# Altium schematic sheet [2]_Power.SchDoc
size B
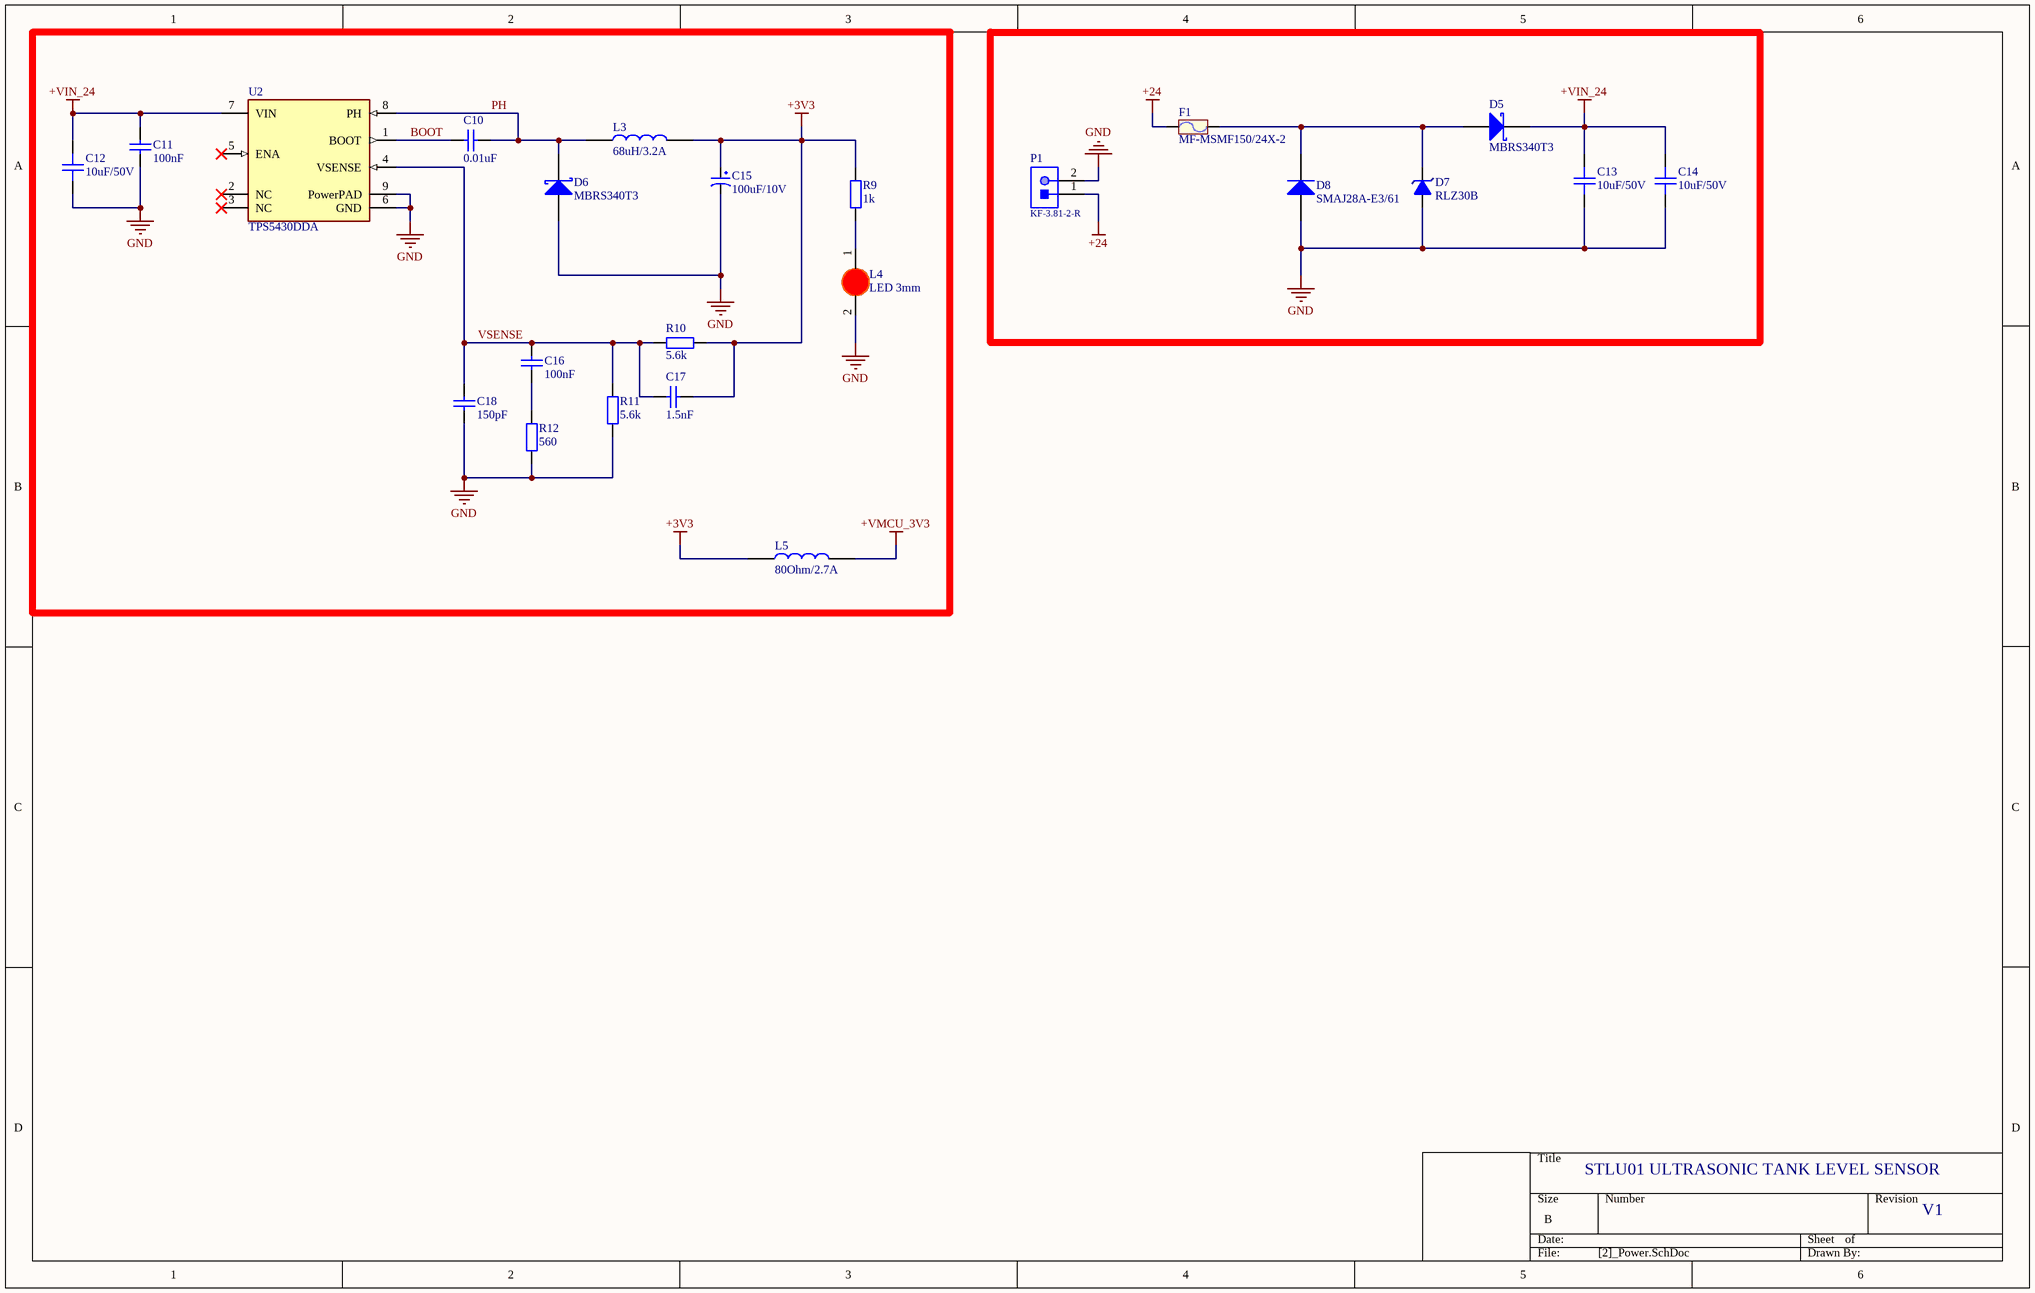
[diagram p0: [2]_Power.SchDoc]

## Parts
C10  0.01uF  [tu 0603]
C11  100nF  [tu 0805]
C12  10uF/50V  [1210]
C13  10uF/50V  [1210]
C14  10uF/50V  [1210]
C15  100uF/10V  [2312]
C16  100nF  [tu 0805]
C17  1.5nF  [tu 0805]
C18  150pF  [tu 0805]
D5  MBRS340T3  [DO214AB_SMC]
D6  MBRS340T3  [DO214AB_SMC]
D7  RLZ30B  [SOD_80]
D8  SMAJ28A-E3/61  [VISH-DO-214AC-2_L]
F1  MF-MSMF150/24X-2  [1812]
L3  68uH/3.2A  [IND-12_12_8]
L4  LED 3mm  [LED-3MM-RED]
L5  80Ohm/2.7A  [FER-0805 (2012)]
P1  KF-3.81-2-R  [691322310002]
R9  1k  [tro smd 0805]
R10  5.6k  [tro smd 0805]
R11  5.6k  [tro smd 0805]
R12  560  [tro smd 0805]
U2  TPS5430DDA  [FP-DDA0008J-MFG]

## Nets
+3V3: C15.1 C17.2 L3.2 L5.1 R9.2 R10.1
+24: F1.1 P1.1
+VIN_24: C11.1 C12.2 C13.2 C14.2 D5.2(K) U2.7(VIN)
+VMCU_3V3: L5.2
GND: C11.2 C12.1 C13.1 C14.1 C15.2 C18.2 D6.1(A) D7.1(A) D8.2(A) L4.2(K) P1.2 R11.1 R12.1 U2.6(GND) U2.9(PowerPAD)
BOOT: C10.2 U2.1(BOOT)
PH: C10.1 D6.2(K) L3.1 U2.8(PH)
VSENSE: C16.1 C17.1 C18.1 R10.2 R11.2 U2.4(VSENSE)
NetC16_2: C16.2 R12.2
NetD5_1: D5.1(A) D7.2(K) D8.1(K) F1.2
NetL4_1: L4.1(A) R9.1

Not connected (* = marked no-connect by the designer): U2 2(NC)* 3(NC)* 5(ENA)*

## Notes on the sheet
- STLU01 ULTRASONIC TANK LEVEL SENSOR
- V1

## Library data of the parts
C10 = Tu 0603 105 16V 20%: Dán; Don_Vi: Con; So_Chan: 2; Ten_Linh_Kien: Tụ 0603 105-1uF 20% 16V; Ma_Hang: MH004574; Chung_Loai: Dán; Kieu_Chan: *
C11 C16-C18 = Tu 0805 10pF 50V 10%: Dán; Don_Vi: Con; So_Chan: 2; Ten_Linh_Kien: Tụ 0805 10P 10% 50V; Ma_Hang: MH004554; Chung_Loai: Dán; Kieu_Chan: *
  C17 C18: ComponentLink1Description: New link; ComponentLink1URL: https://www.thegioiic.com/tu-gom-0805-150pf-50v
C12-C14 = CAP_CER_1210_10uF: CAP CER 10uF/50V 1210; Manufacturer: Yageo; Part number: C1210; Cost: 3400; ComponentLink1Description: Link product; ComponentLink1URL: https://www.thegioiic.com/tu-gom-1210-10uf-50v; Package: 1210
C15 = CAP_TANT_2312_100uF: CAP TANT 100uF/10V 2312; Manufacturer: AVX; Part number: TAJC107K010RNJ; Cost: 5000; ComponentLink1Description: Link product; ComponentLink1URL: https://www.thegioiic.com/tu-tantalum-100uf-10v-2312-tajc107k010rnj; Package: 2312
D5 D6 = DIO_MBRS340T3: DIODE SCHOTTKY 4A 40V SMC DO-214AB; Manufacturer: Fairchild; Part number: SS14; Cost: 2000; Package: DO-214AB; ComponentLink1Description: Link product; ComponentLink1URL: https://www.thegioiic.com/mbrs340t3-diode-schottky-4a
D7 = DIO_ZMM15: ZMM15 15V 500mW SMD SOD-80; Manufacturer: On Semiconductor; Cost: 250; Part number: ZMM15; Package: SOD-80 2L; ComponentLink1Description: Link product; ComponentLink1URL: https://www.thegioiic.com/rlz30b-diode-zener-27-70-29-13v-500mw-smd
D8 = CMP-0548-00227-2: Transient Voltage Suppressor, 6.40 to 231 V, 28 V Stand-off Voltage, Uni-Directional, -55 to 155 degC, 2-pin DO-214AC, Pb-Free, Tape and Reel; Manufacturer: Vishay Semiconductor; IFSM: 40 A; VBR Uni-Directional (V): 6.4 to 231; ID (uA): 1; VWM (V): 28; PPPM (W): 400, 300; PackageReference: DO-214AC-2; Packing: Tape and Reel; RoHS: TRUE; PartNumber: SMAJ28A-E3/61; PackageDescription: 2-Pin DO-214AC (SMA), Body 4.245 x 2.665 mm; Mounting Technology: Surface Mount; DatasheetVersion: 12/8/2013; Operating Junction and Storage Temperature Range: -55 to 150 degC; ComponentLink4Description: New link; ComponentLink4URL: https://www.thegioiic.com/smaj28a-e3-61-tvs-diode-28v-45-4v-do214ac
F1 = FUSE_16V_2.5A: MF-MSMF250/16 16V 2.5A1812; Manufacturer: Bourns; Cost: 3000; Part number: 1812; ComponentLink1Description: Link product; ComponentLink1URL: https://www.thegioiic.com/mf-msmf150-24x-2-cau-chi-tu-phuc-hoi-1812-24v-1-5a; Package: 1812
L3 = IND_68uH_3.2A_1280: CDRH127 IND 68uH 3.2A 12x12x8; Manufacturer: OEM; Cost: 3200; Part number: CDRH127; Package: 1280; ComponentLink1Description: Link product; ComponentLink1URL: https://www.thegioiic.com/cdrh127-cuon-cam-dan-smd-1280-680-68uh-3-2a
L4 = LED 3mm Do: Cắm; Don_Vi: Con; Ma_Hang: MH003892; Ten_Linh_Kien: Led 3MM Phủ Đỏ (10c); Ghi_Chu: *; Kieu_Chan: *; Chung_Loai: Cắm
L5 = FERRITE_BEAD_2.7A_80: FERRITE BEAD 2.7A 80 OHM 0805; Manufacturer: Taiyo Yuden; Part number: FBMH2012HM800-T; Cost: 2000; Package: 0805; ComponentLink1Description: Link product; ComponentLink1URL: https://www.thegioiic.com/fbmh2012hm800-t-ferrite-bead-80-ohm-0805
P1 = CMP-1502-01886-1: Serie 322 - 3.81mm Horizontal PCB Header WR-TBL, 2 pin; Manufacturer: Wurth Elektronik; Gender: Male; Pin Number: 2; Publisher: WurthElektronik; Pitch: 3.81mm; Packaging: Box; Part Number: 691322310002; Manufacturer URL: http://www.we-online.de; Operating Temperature: -40to105degC; Mounting Technology: THT; Datasheet URL: http://katalog.we-online.de/em/datasheet/6913223100xx.pdf; Package Reference: 691322310002
R9-R12 = Tro 0805 1% 5.1k: Dán; Don_Vi: Con; So_Chan: 2; Ten_Linh_Kien: Trở 0805 1% 5.1k; Ma_Hang: MH008812; Chung_Loai: Dán; Kieu_Chan: *
U2 = CMP-2000-04960-2: IC REG BUCK ADJUSTABLE 3A 8SOPWR; Manufacturer: Texas Instruments; Max Junction Temp: +125°C; Max Supply Voltage: 36V; Switching Frequency: 500kHz; Output Type: AdjustableProgrammable; Standoff Height: 0mm; Output Voltage: 1.23-31V; Max Duty Cycle: 89%; Nominal Supply Current: 3mA; Min Supply Voltage: 5.5V; Number Of Outputs: 1; Temperature: -40°C to +125°C; Temperature Range High: +125°C; Manufacturer Part Number: TPS5430DDA; Device Class L3: Voltage Regulators - Switching; Mouser Description: Voltage Regulators - Switching Regulators 5.5 to 36V Input 3A Step Dwn Converter; Switching Topology: Buck; ComponentLink2URL: http://www.ti.com/lit/ds/symlink/tps5431.pdf; ComponentLink2Description: Datasheet; Device Class L2: Power Management ICs; Device Class L1: Integrated Circuits (ICs); Digikey Description: IC REG BUCK ADJUSTABLE 3A 8SOPWR; RoHS: TRUE; Octopart: https://octopart.com/tps5430dda-texas+instruments-589977; Output Current: 3A; Automotive: No; Lead Free: Yes; Category: IC; Package: DDA0008J; Temperature Range Low: -40°C; Height: 1.7mm